# Altium schematic sheet High-Speed Interfaces.SchDoc
size B; SheetNumber: 2; SheetTotal: 8
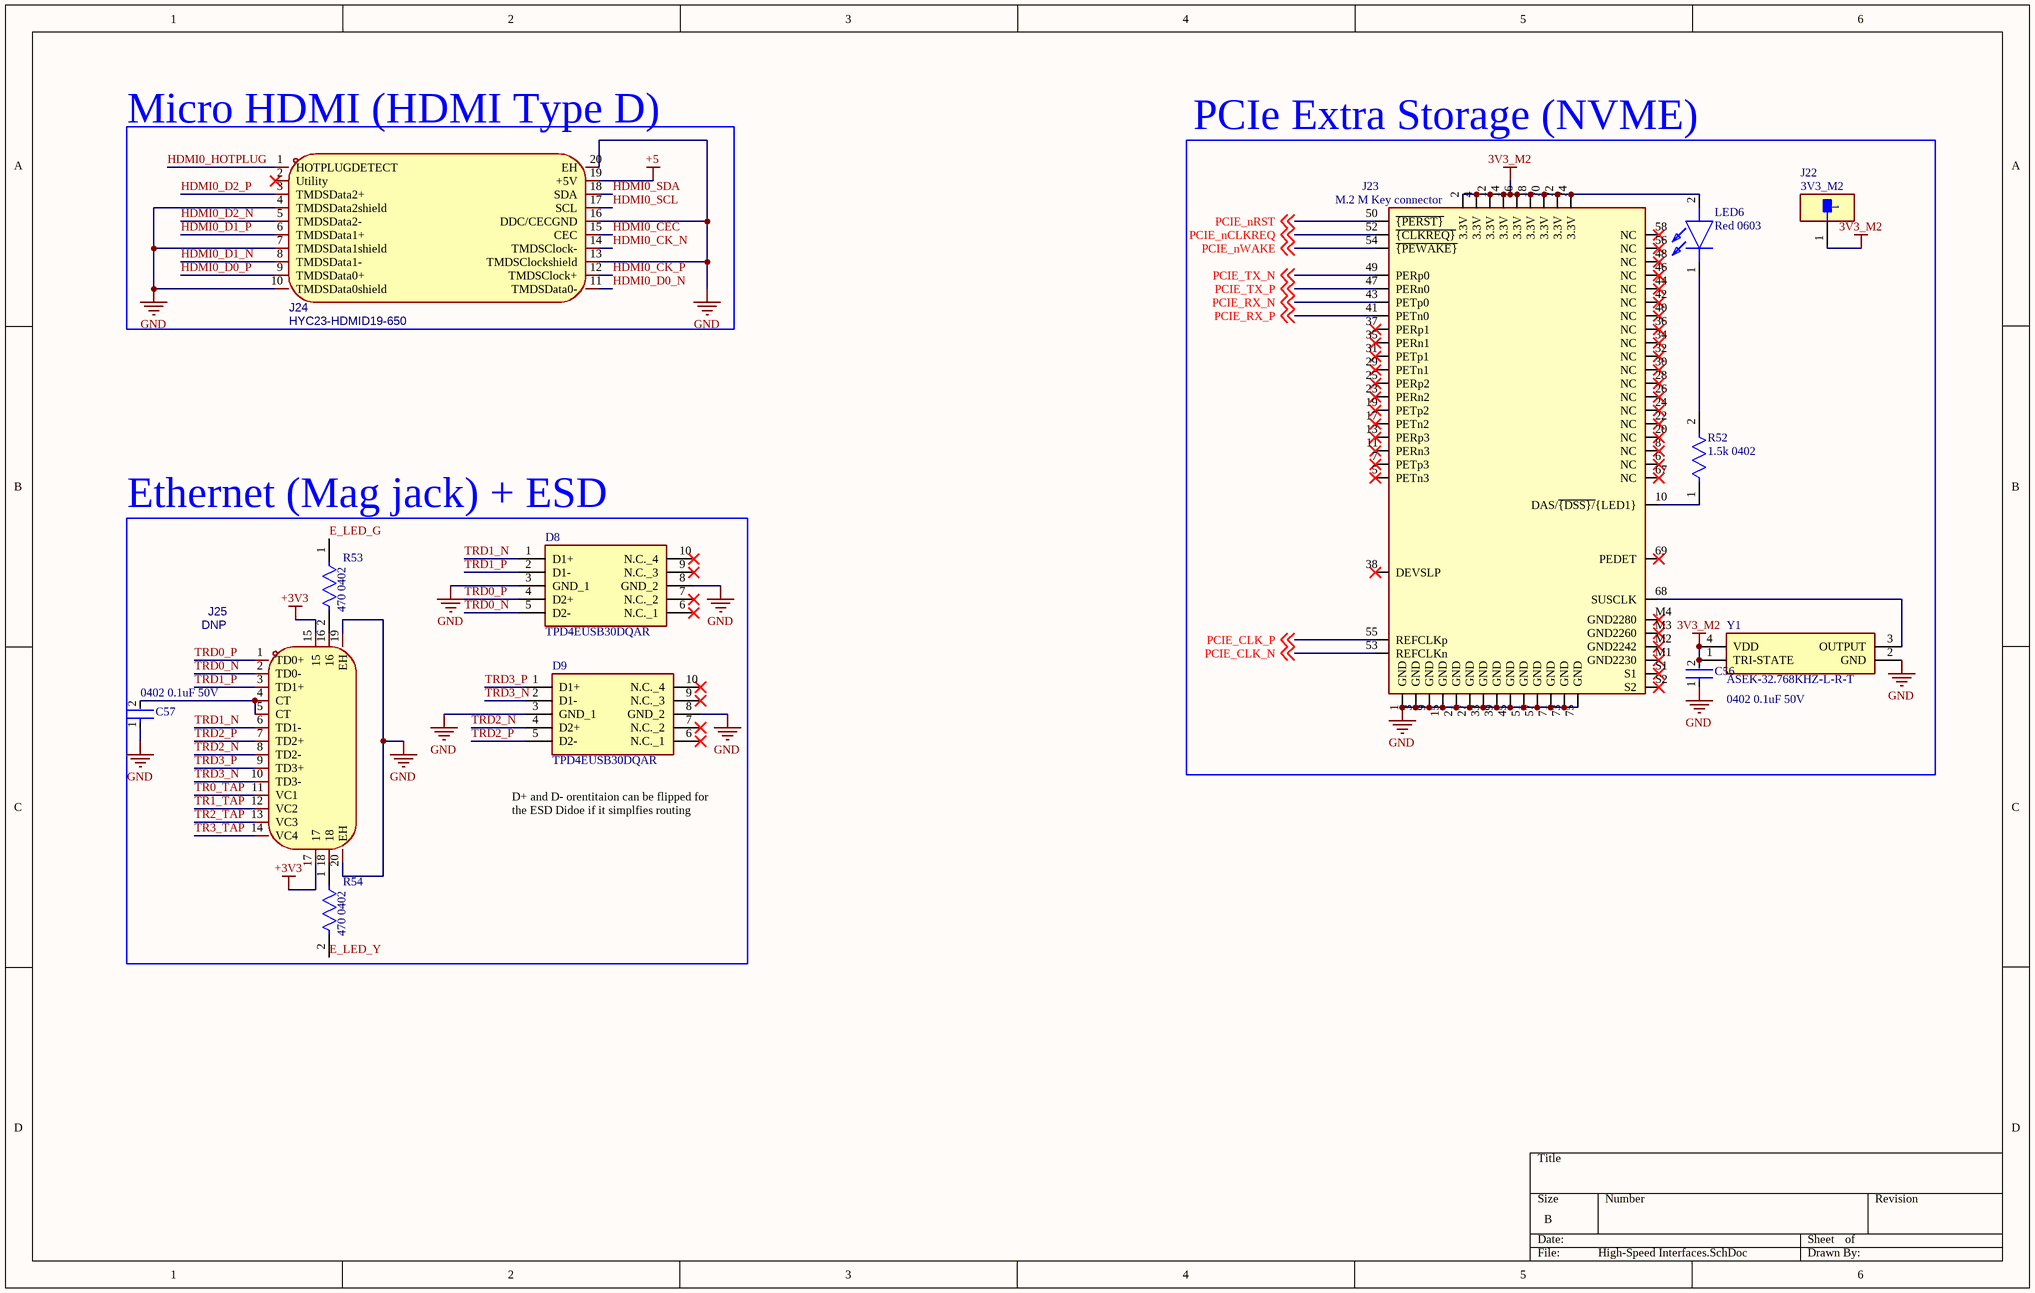
[diagram p0: High-Speed Interfaces.SchDoc]

## Parts
C56  0402 0.1uF 50V  [FP-C0402-BB-MFG]
C57  0402 0.1uF 50V  [FP-C0402-BB-MFG]
D8  TPD4EUSB30DQAR  [DQA(R-PUSON-N10)]
D9  TPD4EUSB30DQAR  [DQA(R-PUSON-N10)]
J22  3V3_M2  [FP-5015-MFG]
J23  M.2 M Key connector  [M.2 M Key connector RPI]
J24  HYC23-HDMID19-650  [AUDIO-TH_HYC23-HDMID19-650]
J25  DNP  [RJ45-TH_LPJG0926HENL_C22457393]
LED6  Red 0603  [LEDC1608X70N]
R52  1.5k 0402  [FP-AF0402-IPC_B]
R53  470 0402  [FP-RMCF0402-MFG]
R54  470 0402  [FP-RMCF0402-MFG]
Y1  ASEK-32.768KHZ-L-R-T  [ASEK32768KHZLRT]

## Blocks framed on the sheet
Micro HDMI (HDMI Type D): J24
PCIe Extra Storage (NVME): C56 J22 J23 LED6 R52 Y1
Ethernet (Mag jack) + ESD: C57 D8 D9 J25 R53 R54

## Nets
3V3_M2: C56.2 J22.1 J23.2(3.3V) J23.4(3.3V) J23.12(3.3V) J23.14(3.3V) J23.16(3.3V) J23.18(3.3V) J23.70(3.3V) J23.72(3.3V) J23.74(3.3V) LED6.2(A) Y1.1(TRI-STATE) Y1.4(VDD)
+3V3: J25.15 J25.17
+5: J24.19(+5V)
GND: C56.1 C57.1 D8.3(GND_1) D8.8(GND_2) D9.3(GND_1) D9.8(GND_2) J23.1(GND) J23.3(GND) J23.9(GND) J23.15(GND) J23.21(GND) J23.27(GND) J23.33(GND) J23.39(GND) J23.45(GND) J23.51(GND) J23.57(GND) J23.71(GND) J23.73(GND) J23.75(GND) J24.4(TMDSData2shield) J24.7(TMDSData1shield) J24.10(TMDSData0shield) J24.13(TMDSClockshield) J24.16(DDC/CECGND) J24.20(EH) J25.19(EH) J25.20(EH) Y1.2(GND)
E_LED_G: R53.1
E_LED_Y: R54.2
HDMI0_CEC: J24.15(CEC)
HDMI0_CK_N: J24.14(TMDSClock-)
HDMI0_CK_P: J24.12(TMDSClock+)
HDMI0_D0_N: J24.11(TMDSData0-)
HDMI0_D0_P: J24.9(TMDSData0+)
HDMI0_D1_N: J24.8(TMDSData1-)
HDMI0_D1_P: J24.6(TMDSData1+)
HDMI0_D2_N: J24.5(TMDSData2-)
HDMI0_D2_P: J24.3(TMDSData2+)
HDMI0_HOTPLUG: J24.1(HOTPLUGDETECT)
HDMI0_SCL: J24.17(SCL)
HDMI0_SDA: J24.18(SDA)
PCIE_CLK_N: J23.53(REFCLKn) ; off-sheet PCIE_CLK_N
PCIE_CLK_P: J23.55(REFCLKp) ; off-sheet PCIE_CLK_P
PCIE_nCLKREQ: J23.52(~{{CLKREQ}}) ; off-sheet PCIE_nCLKREQ
PCIE_nRST: J23.50(~{{PERST}}) ; off-sheet PCIE_nRST
PCIE_nWAKE: J23.54(~{{PEWAKE}}) ; off-sheet PCIE_nWAKE
PCIE_RX_N: J23.43(PETp0) ; off-sheet PCIE_RX_N
PCIE_RX_P: J23.41(PETn0) ; off-sheet PCIE_RX_P
PCIE_TX_N: J23.49(PERp0) ; off-sheet PCIE_TX_N
PCIE_TX_P: J23.47(PERn0) ; off-sheet PCIE_TX_P
TR0_TAP: J25.11(VC1)
TR1_TAP: J25.12(VC2)
TR2_TAP: J25.13(VC3)
TR3_TAP: J25.14(VC4)
TRD0_N: D8.5(D2-) J25.2(TD0-)
TRD0_P: D8.4(D2+) J25.1(TD0+)
TRD1_N: D8.1(D1+) J25.6(TD1-)
TRD1_P: D8.2(D1-) J25.3(TD1+)
TRD2_N: D9.4(D2+) J25.8(TD2-)
TRD2_P: D9.5(D2-) J25.7(TD2+)
TRD3_N: D9.2(D1-) J25.10(TD3-)
TRD3_P: D9.1(D1+) J25.9(TD3+)
NetC57_2: C57.2 J25.4(CT) J25.5(CT)
NetJ23_10: J23.10(DAS/~{{DSS}/}{LED1}) R52.1
NetJ23_68: J23.68(SUSCLK) Y1.3(OUTPUT)
NetJ25_16: J25.16 R53.2
NetJ25_18: J25.18 R54.1
NetLED6_1: LED6.1(K) R52.2

Not connected (* = marked no-connect by the designer): D8 6(N.C._1)* 7(N.C._2)* 9(N.C._3)* 10(N.C._4)*; D9 6(N.C._1)* 7(N.C._2)* 9(N.C._3)* 10(N.C._4)*; J23 5(PETn3)* 6(NC)* 7(PETp3)* 8(NC)* 11(PERn3)* 13(PERp3)* 17(PETn2)* 19(PETp2)* 20(NC)* 22(NC)* 23(PERn2)* 24(NC)* 25(PERp2)* 26(NC)* 28(NC)* 29(PETn1)* 30(NC)* 31(PETp1)* 32(NC)* 34(NC)* 35(PERn1)* 36(NC)* 37(PERp1)* 38(DEVSLP)* 40(NC)* 42(NC)* 44(NC)* 46(NC)* 48(NC)* 56(NC)* 58(NC)* 67(NC)* 69(PEDET)* M1(GND2230)* M2(GND2242)* M3(GND2260)* M4(GND2280)* S1* S2*; J24 2(Utility)*

## Notes on the sheet
- (near D9) D+ and D- orentitaion can be flipped for the ESD Didoe if it simplfies routing

## Library data of the parts
C56 C57 = CMP-03020-014070-2: C307331; Manufacturer: Kemet; Manufacturer Part Number: C0402C104M3PAC7867; Material: Ceramic; Tolerance: 0.2; Temperature Characteristic: X5R; Value: 0.10 μF; Temperature Coefficient: 15%; Voltage Rating: 25 V; Height: 0.55mm; Category: Cap; Temperature: -55°C to +125°C; Automotive: No; Package: C0402-BB; Temperature Range Low: -55°C; ComponentLink2Description: Datasheet; Device Class L3: Ceramic Capacitors; ComponentLink2URL: https://content.kemet.com/datasheets/KEM_C1002_X7R_SMD.pdf; Octopart: https://octopart.com/c0402c104m3pac7867-kemet-84304880; RoHS: TRUE; Temperature Range High: +125°C; Device Class L1: Passive Components; Capacitance: 0.10 μF; Lead Free: Yes; Ipc Land Pattern Name: CAPC10050X50; Device Class L2: Capacitors; Digikey Description: CAP CER 0.1UF 25V X5R 0402
D8 D9 = TPD4EUSB30DQAR: C90627; Manufacturer_Name: Texas Instruments; Datasheet Link: http://www.ti.com/lit/gpn/tpd4eusb30; Manufacturer_Part_Number: TPD4EUSB30DQAR; Mouser Part Number: 595-TPD4EUSB30DQAR; Mouser Price/Stock: https://www.mouser.co.uk/ProductDetail/Texas-Instruments/TPD4EUSB30DQAR?qs=Ze4%2FuFuz19JpY4uqYOLMbQ%3D%3D; Arrow Part Number: TPD4EUSB30DQAR; Arrow Price/Stock: https://www.arrow.com/en/products/tpd4eusb30dqar/texas-instruments.html?utm_currency=USD&region=nac
J22 = CMP-2000-05183-2: PC TEST POINT MINIATURE; Manufacturer Part Number: 5015; Manufacturer: keystone; Number Of Contacts: 1; Conn Orientation: Straight; Category: Conn; Digikey Description: PC TEST POINT MINIATURE; Automotive: No; Lead Free: Yes; Octopart: https://octopart.com/5015-keystone-3822; ComponentLink2URL: http://www.keyelco.com/product-pdf.cfm?p=1353; Package: 5015; RoHS: TRUE; Device Class L3: unset; Device Class L2: unset; Contact Material: Silver; Device Class L1: Connectors; Height: 1.65mm; ComponentLink2Description: Datasheet
J23 = M.2 M Key connector RPI: C841661; Gender: Female; Number of Positions: 67; Contact Current Rating: 500mA; Pitch: 0.5mm; SM P/N: 13806721; PCB Mounting Orientation: Right Angle; Termination: Solder; Insulation Material: Thermoplastic; Number of Rows: 2; Housing Color: Black; Min Operating Temperature: -40°C; ELV: Compliant; Height: 0.165inch; Orientation: Right Angle; Contact Plating: Gold,Matte; Mount: Surface Mount; Length: 0.862inch; Width: 8.7mm; RoHS Compliant: Yes; Housing Material: Thermoplastic; Packaging: Tape and Reel; Color: Black; Contact Material: Copper Alloy; Max Operating Temperature: 80°C
J24 = HDMI: C711358; Manufacturer: 华宇创; Add into BOM: yes; Connector Type: HDMI-D; Gender: Female; Current Rating: 300mA; Symbol: HYC23-HDMID19-650; Device: HYC23-HDMID19-650; LCSC Part Name: HDMI-D 母 19P; Supplier Part: C711358; Manufacturer Part: HYC23-HDMID19-650; Supplier Footprint: SMD; JLCPCB Part Class: Extended Part; Datasheet: https://item.szlcsc.com/datasheet/HYC23-HDMID19-650/750253.html; Supplier: LCSC; Convert to PCB: yes; Number of Pins: 19P; Mounting Type: Surface Mount, Right Angle; Voltage Rating: -; Operating Temperature: -40℃~+85℃
J25 = Ethernet Correct: C22457393; Manufacturer: LINK-PP(连普科技); Manufacturer Part: LPJG0926HENL; Symbol: LPJG0926HENL_C22457393; Add into BOM: yes; Connector Type: RJ45 Jack; Number of Ports: 1; LED: With LED; Shielding: Shielded; PoE: Non-PoE; Device: LPJG0926HENL_C22457393; LCSC Part Name: 弯插 带LED; Supplier Part: C22457393; Supplier Footprint: 插件; JLCPCB Part Class: Extended Part; Datasheet: https://item.szlcsc.com/datasheet/LPJG0926HENL/24125913.html; Supplier: LCSC; Convert to PCB: yes; Mounting Type: Right Angle; Contact Material: Phosphor Bronze; Contact Plating: Gold; Operating Temperature: 0℃~+70℃
LED6 = KT-0603R: C2286; Manufacturer_Name: Hubei KENTO Elec; Datasheet Link: https://datasheet.lcsc.com/szlcsc/Hubei-KENTO-Elec-KT-0603R_C2286.pdf; Height: 0.7mm; Manufacturer_Part_Number: KT-0603R; LCSC: C2286
R52 = CMP-03412-049911-1: C25867; Resistance: 4.3kR; Max Power Dissipation: 63mW; Temperature Coefficient: 100ppm/°C; Tolerance: 5%; Case/Package: 0402; Height: 0.015inch; Width: 0.02inch; Min Operating Temperature: -55°C; Packaging: Tape and Reel; Max Operating Temperature: 155°C; Features: Moisture Resistant; Series: AF; Number of Terminations: 2; Length: 0.039inch; Resistor Type: Thick Film; RoHS Compliant: Yes
R53 R54 = CMP-26527-002093-1: C25117; Max Power Dissipation: 63mW; Tolerance: 5%; Resistance: 3.9R; Temperature Coefficient: 200ppm/°C; Case/Package: 0402; Number of Terminations: 2; Min Operating Temperature: -55°C; Height: 0.016inch; Packaging: Tape and Reel; Resistor Type: Thick Film; Length: 0.039inch; Mount: Surface Mount; Series: RMCF; Max Operating Temperature: 155°C; Contact Plating: Tin; Features: Automotive AEC-Q200; Width: 0.02inch; Radiation Hardening: No; RoHS Compliant: Yes
Y1 = ASEK-32.768KHZ-L-R-T: C2650753; Manufacturer_Name: ABRACON; Datasheet Link: https://abracon.com/Oscillators/ASEK.pdf; Height: 1.2mm; Manufacturer_Part_Number: ASEK-32.768KHZ-L-R-T